# EAGLE board UFBmod_2V0 (EAGLE 7.7.0)
UFBmod - the best digital modulation ever created :-)
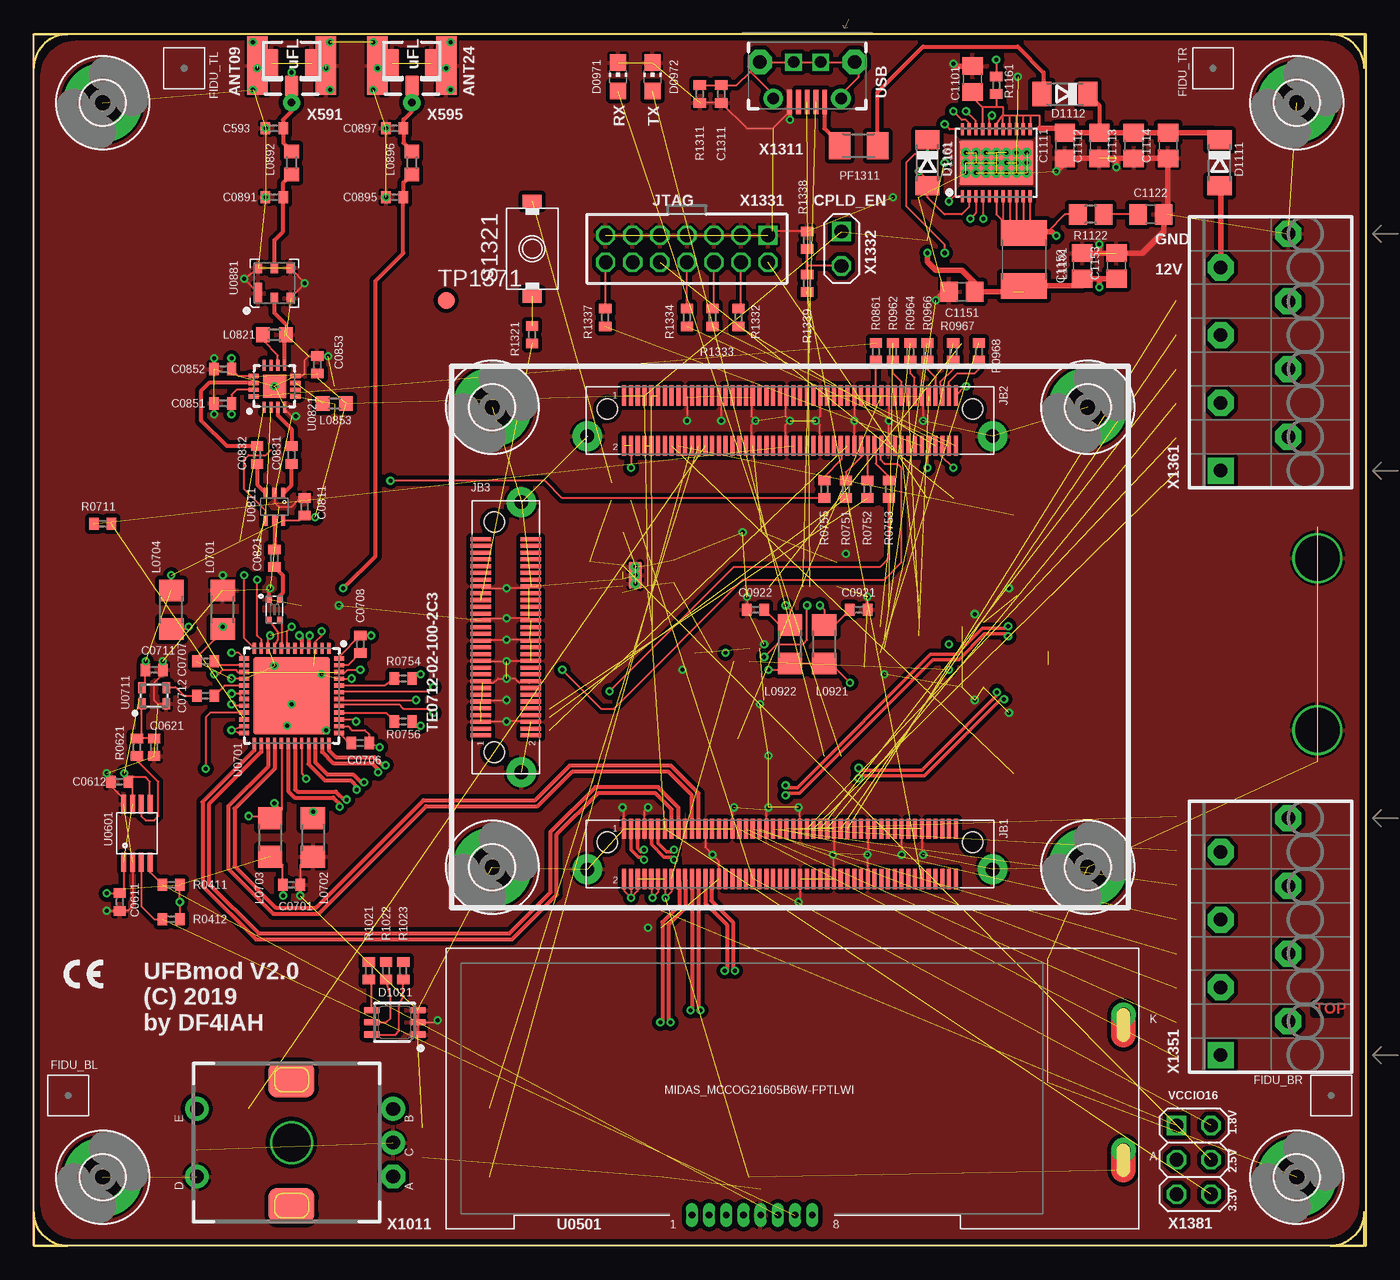
[diagram p15: board, top side]
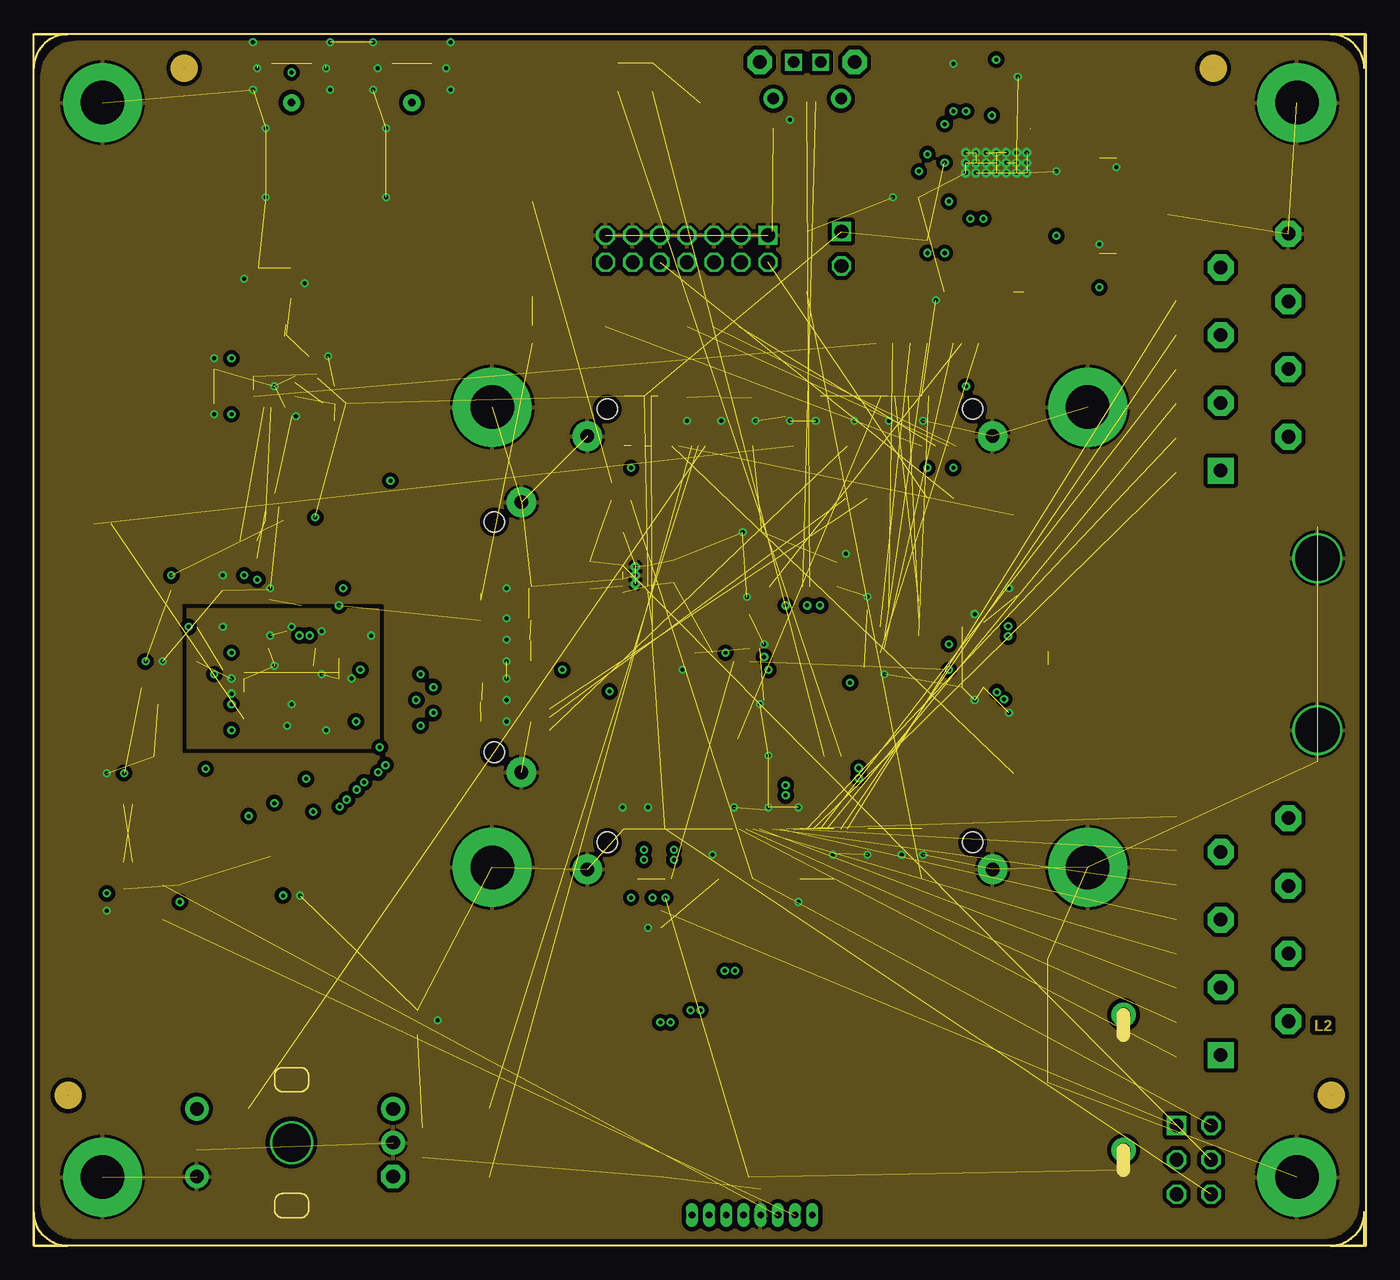
[diagram p16: board, inner layer Route2]
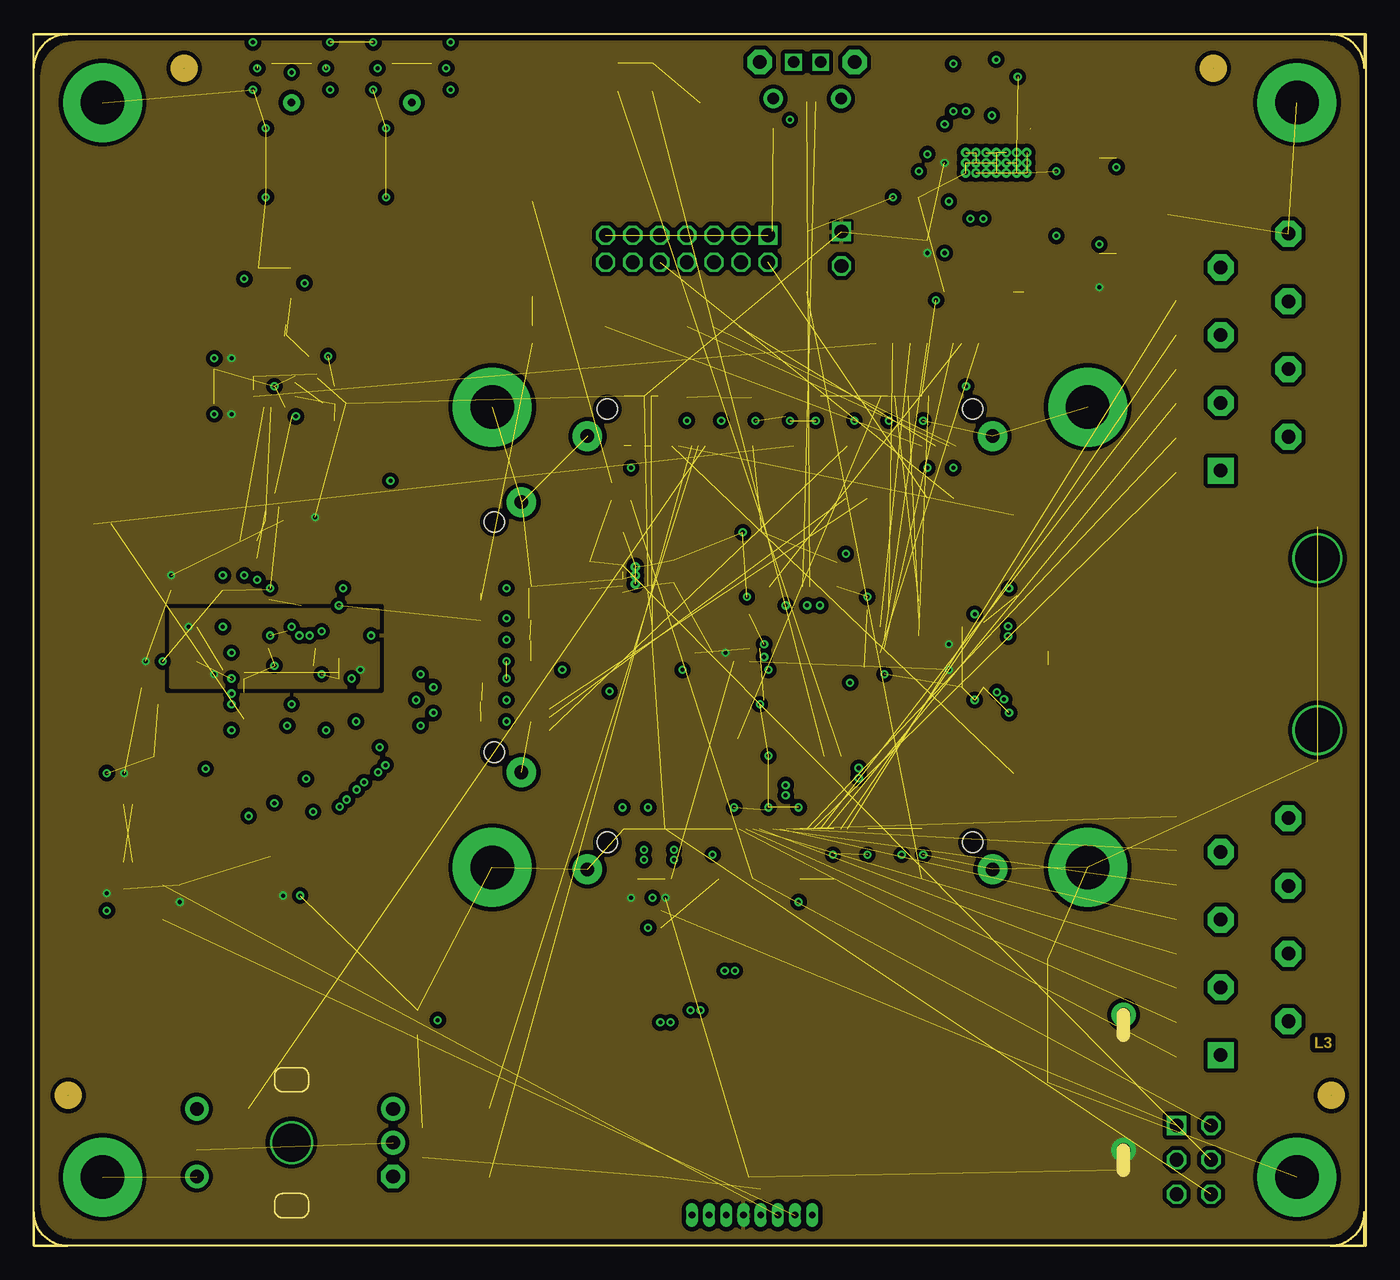
[diagram p17: board, inner layer Route15]
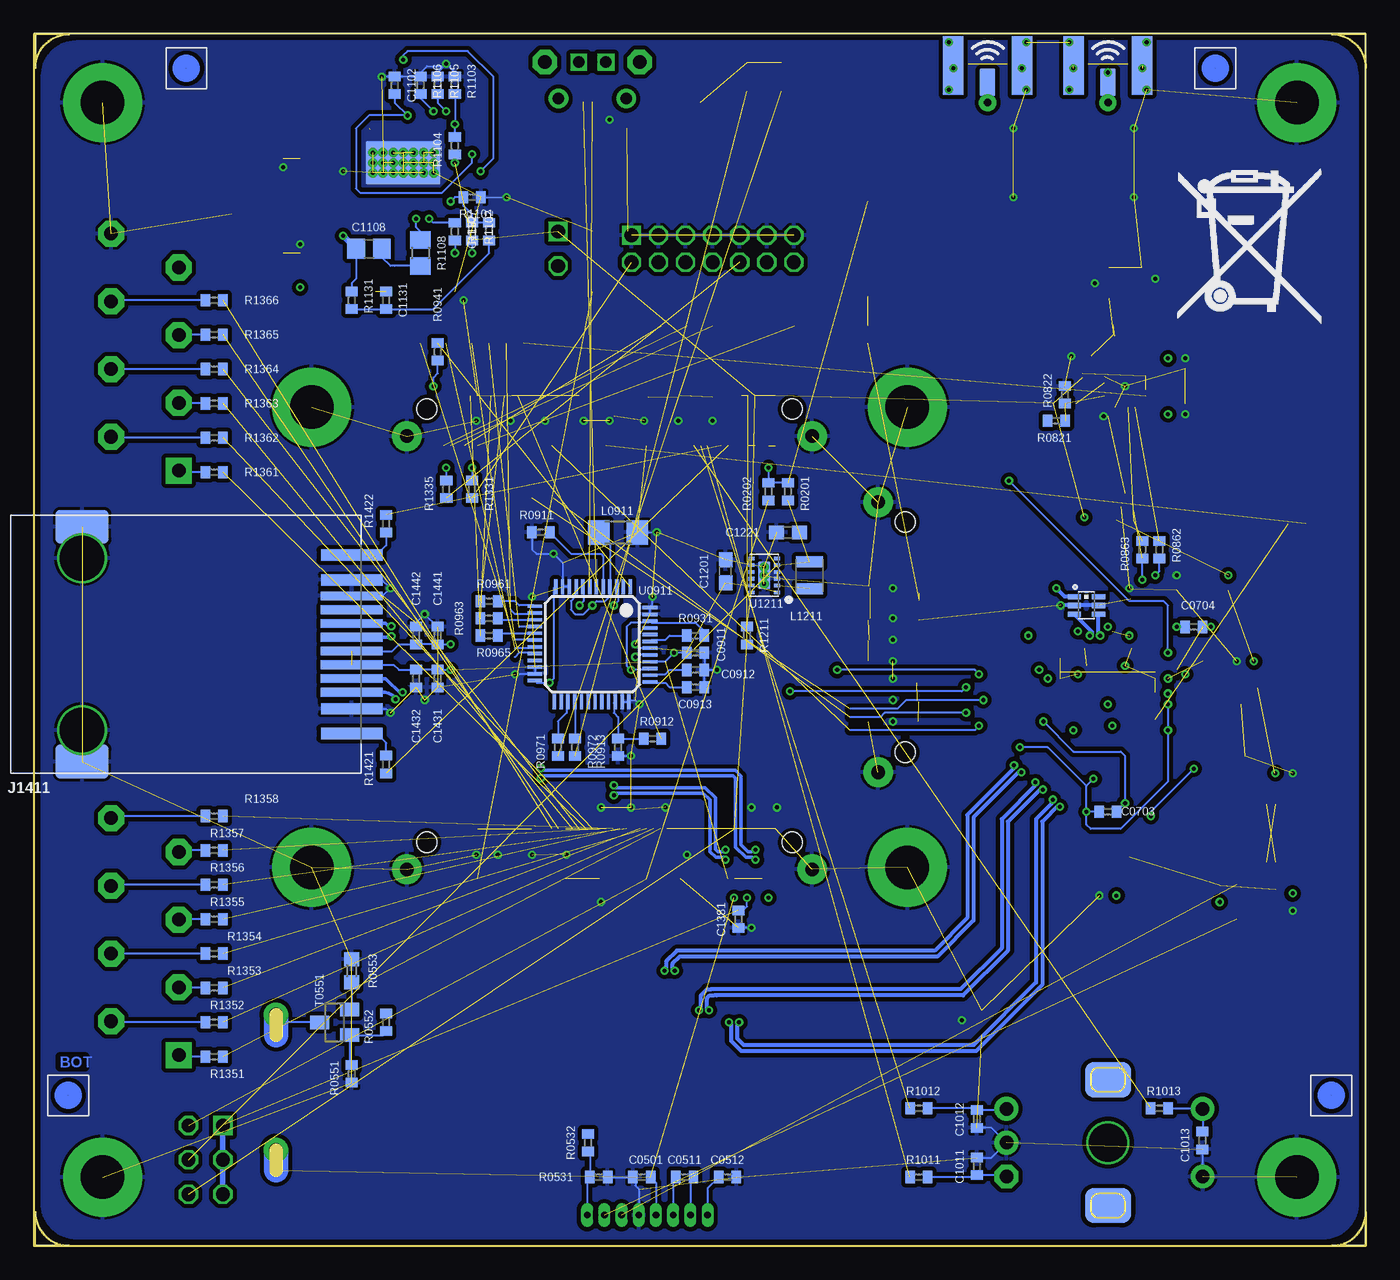
[diagram p18: board, bottom side, seen from below]

Size 98.42 x 89.53 mm. Coordinates in mm from the lower left corner, seen from the top.
Outline: 0,0 0,89.53 98.42,89.53 98.42,0 0,0
Copper layers (1+2*15+16): Top 0.035mm / dielectric 0.38mm / Route2 0.035mm / dielectric 0.71mm / Route15 0.035mm / dielectric 0.38mm / Bottom 0.035mm
Design rules "PCB-POOL Standard_ML4": minimum track width 0.15mm, minimum drill 0.3mm, track to track 0.15mm, track to pad 0.15mm, pad to pad 0.15mm, via to via 0.15mm, smd to smd 0.15mm, copper to edge 0.3mm, drill to drill 0.2mm, minimum pad ring 0.2mm, minimum via ring 0.15mm, stop-mask expansion 0.075mm, vias tented up to drill 0mil, thermal gap 0.2mm
Net classes: 0 default: drill 0.3 mm; 1 diff_100R: width 0.3 mm, clearance 0.15 mm; 2 pwr_ttl: width 0.75 mm, clearance 0.5 mm; 3 usb_pair: width 0.254 mm, clearance 0.152 mm; 4 pwrA5: width 0.4 mm; 5 single50R: width 0.838 mm, clearance 0.152 mm; 6 mil6_nofill: width 0.152 mm, clearance 0.254 mm
Milling: area 0,87 to 2.5,89.5; area 0,0 to 2.5,2.5; area 95.8,0 to 98.3,2.5; area 95.8,87 to 98.3,89.5

## Footprints (pad centres in the part's own frame; a part is rotated, then mirrored left to right if it is on the bottom)
C0402 = smd 0.7 x 0.9: 1 -0.65,0; 2 0.65,0
C0805 = smd 1.3 x 1.5: 1 -0.95,0; 2 0.95,0
C0603 = smd 1.1 x 1: 1 -0.85,0; 2 0.85,0
CHIP-LED0805 = smd 1.2 x 1.2: A 0,-1.05; C 0,1.05
ASMT-YTB7_0AA02_RGB = smd 1.2 x 0.5: 1 -1.7,0.9; 2 -1.7,0; 3 -1.7,-0.9; 4 1.7,-0.9; 5 1.7,0; 6 1.7,0.9
SOD80C = smd 1.4 x 1.8: A 1.7,0; C -1.7,0
3,2-PAD = drill 3.2 pad 5.842: B3,2 0,0
ARJE-0034_RJ45_WITH_MAGNETICS = smd 0.813 x 4.597: 1 6.604,11.43; 2 4.775,11.43; 11 -4.75,11.43; 12 -6.579,11.43 | smd 0.61 x 4.597: 3 3.556,11.43; 4 2.54,11.43; 5 1.524,11.43; 6 0.508,11.43; 7 -0.508,11.43; 8 -1.524,11.43; 9 -2.54,11.43; 10 -3.556,11.43 | smd 2.489 x 3.912: GND@11 -8.674,-8.496; GND@21 8.674,-8.496 | drill 3.3 pad 3.7: GND@12 -6.35,-8.496; GND@22 6.35,-8.496
SAMTEC_LSHM-150-DV = smd 0.3 x 1.5: 1 12.25,-1.85; 2 12.25,1.85; 3 11.75,-1.85; 4 11.75,1.85; 5 11.25,-1.85; 6 11.25,1.85; 7 10.75,-1.85; 8 10.75,1.85; 9 10.25,-1.85; 10 10.25,1.85; 11 9.75,-1.85; 12 9.75,1.85; 13 9.25,-1.85; 14 9.25,1.85; 15 8.75,-1.85; 16 8.75,1.85; 17 8.25,-1.85; 18 8.25,1.85; 19 7.75,-1.85; 20 7.75,1.85; 21 7.25,-1.85; 22 7.25,1.85; 23 6.75,-1.85; 24 6.75,1.85; 25 6.25,-1.85; 26 6.25,1.85; 27 5.75,-1.85; 28 5.75,1.85; 29 5.25,-1.85; 30 5.25,1.85; 31 4.75,-1.85; 32 4.75,1.85; 33 4.25,-1.85; 34 4.25,1.85; 35 3.75,-1.85; 36 3.75,1.85; 37 3.25,-1.85; 38 3.25,1.85; 39 2.75,-1.85; 40 2.75,1.85; 41 2.25,-1.85; 42 2.25,1.85; 43 1.75,-1.85; 44 1.75,1.85; 45 1.25,-1.85; 46 1.25,1.85; 47 0.75,-1.85; 48 0.75,1.85; 49 0.25,-1.85; 50 0.25,1.85; 51 -0.25,-1.85; 52 -0.25,1.85; 53 -0.75,-1.85; 54 -0.75,1.85; 55 -1.25,-1.85; 56 -1.25,1.85; 57 -1.75,-1.85; 58 -1.75,1.85; 59 -2.25,-1.85; 60 -2.25,1.85; 61 -2.75,-1.85; 62 -2.75,1.85; 63 -3.25,-1.85; 64 -3.25,1.85; 65 -3.75,-1.85; 66 -3.75,1.85; 67 -4.25,-1.85; 68 -4.25,1.85; 69 -4.75,-1.85; 70 -4.75,1.85; 71 -5.25,-1.85; 72 -5.25,1.85; 73 -5.75,-1.85; 74 -5.75,1.85; 75 -6.25,-1.85; 76 -6.25,1.85; 77 -6.75,-1.85; 78 -6.75,1.85; 79 -7.25,-1.85; 80 -7.25,1.85; 81 -7.75,-1.85; 82 -7.75,1.85; 83 -8.25,-1.85; 84 -8.25,1.85; 85 -8.75,-1.85; 86 -8.75,1.85; 87 -9.25,-1.85; 88 -9.25,1.85; 89 -9.75,-1.85; 90 -9.75,1.85; 91 -10.25,-1.85; 92 -10.25,1.85; 93 -10.75,-1.85; 94 -10.75,1.85; 95 -11.25,-1.85; 96 -11.25,1.85; 97 -11.75,-1.85; 98 -11.75,1.85; 99 -12.25,-1.85; 100 -12.25,1.85 | drill 1 pad 2.2: F1 14.975,1.15; F2 -14.975,1.15 | hole 1.5: 13.5,-0.85; -13.5,-0.85
SAMTEC_LSHM-130-DV = smd 0.3 x 1.5: 1 7.25,-1.85; 2 7.25,1.85; 3 6.75,-1.85; 4 6.75,1.85; 5 6.25,-1.85; 6 6.25,1.85; 7 5.75,-1.85; 8 5.75,1.85; 9 5.25,-1.85; 10 5.25,1.85; 11 4.75,-1.85; 12 4.75,1.85; 13 4.25,-1.85; 14 4.25,1.85; 15 3.75,-1.85; 16 3.75,1.85; 17 3.25,-1.85; 18 3.25,1.85; 19 2.75,-1.85; 20 2.75,1.85; 21 2.25,-1.85; 22 2.25,1.85; 23 1.75,-1.85; 24 1.75,1.85; 25 1.25,-1.85; 26 1.25,1.85; 27 0.75,-1.85; 28 0.75,1.85; 29 0.25,-1.85; 30 0.25,1.85; 31 -0.25,-1.85; 32 -0.25,1.85; 33 -0.75,-1.85; 34 -0.75,1.85; 35 -1.25,-1.85; 36 -1.25,1.85; 37 -1.75,-1.85; 38 -1.75,1.85; 39 -2.25,-1.85; 40 -2.25,1.85; 41 -2.75,-1.85; 42 -2.75,1.85; 43 -3.25,-1.85; 44 -3.25,1.85; 45 -3.75,-1.85; 46 -3.75,1.85; 47 -4.25,-1.85; 48 -4.25,1.85; 49 -4.75,-1.85; 50 -4.75,1.85; 51 -5.25,-1.85; 52 -5.25,1.85; 53 -5.75,-1.85; 54 -5.75,1.85; 55 -6.25,-1.85; 56 -6.25,1.85; 57 -6.75,-1.85; 58 -6.75,1.85; 59 -7.25,-1.85; 60 -7.25,1.85 | drill 1 pad 2.2: F1 9.975,1.15; F2 -9.975,1.15 | hole 1.5: 8.5,-0.85; -8.5,-0.85
R1206 = smd 1.6 x 1.803: 1 -1.422,0; 2 1.422,0
DXW21HN5011BL = smd 0.5 x 0.45: 1 -0.775,-0.4; 2 0.775,-0.4; 3 0.775,0.4; 4 -0.775,0.4
2450BL15B050 = smd 0.35 x 1: 1 -0.65,-0.9; 2 0,-0.9; 3 0.65,-0.9; 4 0.65,0.9; 5 0,0.9; 6 -0.65,0.9
L0603 = smd 1 x 1.1: 1 -0.85,0; 2 0.85,0
L1812 = smd 1.9 x 3.4: 1 -1.95,0; 2 1.95,0
L2520 = smd 0.8 x 2: 1 -1,0; 2 1,0
M1206 = smd 1.6 x 2: 1 -1.4,0; 2 1.4,0
R0402 = smd 0.7 x 0.9: 1 -0.65,0; 2 0.65,0
R0603 = smd 1 x 1.1: 1 -0.85,0; 2 0.85,0
R0805 = smd 1.3 x 1.5: 1 -0.95,0; 2 0.95,0
KSR223G_SMD_1POL = smd 1 x 1.4: 1 -3.5,0; 2 3.5,0
SOT23 = smd 1 x 1.4: 1 -0.95,-1.1; 2 0.95,-1.1; 3 0,1.1
B1,27 = smd 1.27 x 1.27: TP 0,0
MIDAS_MCCOG21605B6W-FPTLWI = drill 0.5 pad 0.7 long: 1 18.155,1; 2 19.425,1; 3 20.695,1; 4 21.965,1; 5 23.235,1; 6 24.505,1; 7 25.775,1; 8 27.045,1 | drill 1 pad 1.8: 11 50.05,15.8; 12 50.05,5.8
µMAX8 = smd 1.35 x 0.4: 1 -2.15,0.975; 2 -2.15,0.325; 3 -2.15,-0.325; 4 -2.15,-0.975; 5 2.15,-0.975; 6 2.15,-0.325; 7 2.15,0.325; 8 2.15,0.975
QFN48_7X7-0P5-PAD = smd 0.8 x 0.3: 1 -3.5,2.75; 2 -3.5,2.25; 3 -3.5,1.75; 4 -3.5,1.25; 5 -3.5,0.75; 6 -3.5,0.25; 7 -3.5,-0.25; 8 -3.5,-0.75; 9 -3.5,-1.25; 10 -3.5,-1.75; 11 -3.5,-2.25; 12 -3.5,-2.75; 25 3.5,-2.75; 26 3.5,-2.25; 27 3.5,-1.75; 28 3.5,-1.25; 29 3.5,-0.75; 30 3.5,-0.25; 31 3.5,0.25; 32 3.5,0.75; 33 3.5,1.25; 34 3.5,1.75; 35 3.5,2.25; 36 3.5,2.75 | smd 0.3 x 0.8: 13 -2.75,-3.5; 14 -2.25,-3.5; 15 -1.75,-3.5; 16 -1.25,-3.5; 17 -0.75,-3.5; 18 -0.25,-3.5; 19 0.25,-3.5; 20 0.75,-3.5; 21 1.25,-3.5; 22 1.75,-3.5; 23 2.25,-3.5; 24 2.75,-3.5; 37 2.75,3.5; 38 2.25,3.5; 39 1.75,3.5; 40 1.25,3.5; 41 0.75,3.5; 42 0.25,3.5; 43 -0.25,3.5; 44 -0.75,3.5; 45 -1.25,3.5; 46 -1.75,3.5; 47 -2.25,3.5; 48 -2.75,3.5 | smd 5.65 x 5.65: 49 0,0
ASVTX-13 = smd 0.6 x 0.8: 1 -0.9,-0.6; 2 0.9,-0.6; 3 0.9,0.6; 4 -0.9,0.6
SC-70_6-LEAD_2X1MM25_0P65 = smd 0.4 x 0.8: 1 -0.65,-1; 2 0,-1; 3 0.65,-1; 4 0.65,1; 5 0,1; 6 -0.65,1
QFN16-3X3-0P5-PAD = smd 0.8 x 0.3: 1 -1.55,0.75; 2 -1.55,0.25; 3 -1.55,-0.25; 4 -1.55,-0.75; 9 1.55,-0.75; 10 1.55,-0.25; 11 1.55,0.25; 12 1.55,0.75 | smd 0.3 x 0.8: 5 -0.75,-1.55; 6 -0.25,-1.55; 7 0.25,-1.55; 8 0.75,-1.55; 13 0.75,1.55; 14 0.25,1.55; 15 -0.25,1.55; 16 -0.75,1.55 | smd 1.7 x 1.7: 17 0,0
B3440_3MM-X-3MM = smd 0.65 x 1.55: 1 -1.2,-0.75 | smd 0.65 x 0.8: 2 0,-1.125; 3 1.2,-1.125; 4 1.2,1.125; 5 0,1.125; 6 -1.2,1.125
LQFP48 = smd 1.1 x 0.25: 1 -4.25,2.8; 2 -4.25,2.3; 3 -4.25,1.8; 4 -4.25,1.3; 5 -4.25,0.8; 6 -4.25,0.3; 7 -4.25,-0.2; 8 -4.25,-0.7; 9 -4.25,-1.2; 10 -4.25,-1.7; 11 -4.25,-2.2; 12 -4.25,-2.7; 25 4.25,-2.8; 26 4.25,-2.3; 27 4.25,-1.8; 28 4.25,-1.3; 29 4.25,-0.8; 30 4.25,-0.3; 31 4.25,0.2; 32 4.25,0.7; 33 4.25,1.2; 34 4.25,1.7; 35 4.25,2.2; 36 4.25,2.7 | smd 0.25 x 1.1: 13 -2.8,-4.25; 14 -2.3,-4.25; 15 -1.8,-4.25; 16 -1.3,-4.25; 17 -0.8,-4.25; 18 -0.3,-4.25; 19 0.2,-4.25; 20 0.7,-4.25; 21 1.2,-4.25; 22 1.7,-4.25; 23 2.2,-4.25; 24 2.7,-4.25; 37 2.8,4.25; 38 2.3,4.25; 39 1.8,4.25; 40 1.3,4.25; 41 0.8,4.25; 42 0.3,4.25; 43 -0.2,4.25; 44 -0.7,4.25; 45 -1.2,4.25; 46 -1.7,4.25; 47 -2.2,4.25; 48 -2.7,4.25
DQP-22 = smd 0.28 x 0.85: 1 -2.5,-2.475; 2 -2,-2.475; 3 -1.5,-2.475; 4 -1,-2.475; 5 -0.5,-2.475; 6 0,-2.475; 7 0.5,-2.475; 8 1,-2.475; 9 1.5,-2.475; 10 2,-2.475; 11 2.5,-2.475; 12 2.5,2.475; 13 2,2.475; 14 1.5,2.475; 15 1,2.475; 16 0.5,2.475; 17 0,2.475; 18 -0.5,2.475; 19 -1,2.475; 20 -1.5,2.475; 21 -2,2.475; 22 -2.5,2.475 | smd 5.48 x 3.24: 23 0,0 | smd 5.48 x 3.24 bottom: 24 0,0 | drill 0.3 pad 0.61: P$1 -2.25,-0.75; P$2 -1.5,-0.75; P$3 -0.75,-0.75; P$4 0,-0.75; P$5 0.75,-0.75; P$6 1.5,-0.75; P$7 2.25,-0.75; P$8 -2.25,0; P$9 -1.5,0; P$10 -0.75,0; P$11 0,0; P$12 0.75,0; P$13 1.5,0; P$14 2.25,0; P$15 -2.25,0.75; P$16 -1.5,0.75; P$17 -0.75,0.75; P$18 0,0.75; P$19 0.75,0.75; P$20 1.5,0.75; P$21 2.25,0.75
WSON-12 = smd 0.5 x 0.25: 1 -0.95,1.25; 2 -0.95,0.75; 3 -0.95,0.25; 4 -0.95,-0.25; 5 -0.95,-0.75; 6 -0.95,-1.25; 7 0.95,-1.25; 8 0.95,-0.75; 9 0.95,-0.25; 10 0.95,0.25; 11 0.95,0.75; 12 0.95,1.25 | smd 0.9 x 2: 13 0,0 | smd 0.9 x 2 bottom: 14 0,0 | drill 0.3 pad 0.6: G1 0,0; G2 0,0.635; G3 0,-0.635
SMA_UFL_PAD_TINY = smd 1.524 x 1.016: ANT1 -3.843,0 | drill 0.559 pad 1.27: ANT2 -5.08,0 | smd 2.032 x 1.143 bottom: ANT3 -3.589,0 | smd 2.2 x 1.016: GND1 -2.223,1.47; GND2 -2.223,-1.47 | smd 4.318 x 1.524: GND3 -2.349,-2.54; GND4 -2.349,2.54 | smd 4.318 x 1.524 bottom: GND5 -2.349,2.54; GND6 -2.349,-2.54
TTE_EN11-HSM = drill 1 pad 1.75 octagon: A -2.5,-7.5 | drill 1 pad 1.75: B 2.5,-7.5; C 0,-7.5; D -2.5,7; E 2.5,7 | smd 2.6 x 3.4: GND11 -4.65,0; GND12 4.65,0 | smd 2.6 x 3.4 bottom: GND21 -4.65,0; GND22 4.65,0 | drill 2.8 pad 2.8: P$1 0,0
USB-B-MICRO-SMD_MOLEX-105017-0001 = smd 0.35 x 1.8: D+ 0,4.4; D- -0.65,4.4; GND 1.3,4.4; ID 0.65,4.4; VBUS -1.3,4.4 | drill 0.85 pad 1.45: JSHIELD -2.5,4.15; JSHIELD@2 2.5,4.15 | drill 1 pad 1.8 octagon: JSHIELD@3 -3.5,1.45; JSHIELD@6 3.5,1.45 | drill 0.85 square: JSHIELD@4 -1,1.45; JSHIELD@5 1,1.45
2X07_2MM00_SHROUDED_XILINX_JTAG = drill 1.016 square: 1 -6,-1 | drill 1.016 octagon: 2 -6,1; 3 -4,-1; 4 -4,1; 5 -2,-1; 6 -2,1; 7 0,-1; 8 0,1; 9 2,-1; 10 2,1; 11 4,-1; 12 4,1; 13 6,-1; 14 6,1
1X02 = drill 1.016 square: 1 0,0 | drill 1.016 octagon: 2 0,2.54
PHOENIX_1990067_1X8X2MM50_PTSA-0-5 = drill 1 pad 1.93 square: 1 -7.5,5 | drill 1 pad 1.93 octagon: 2 -5,0; 3 -2.5,5; 4 0,0; 5 2.5,5; 6 5,0; 7 7.5,5; 8 10,0
2X03 = drill 1.016 square: 1 -2.54,-1.27 | drill 1.016 octagon: 2 -2.54,1.27; 3 0,-1.27; 4 0,1.27; 5 2.54,-1.27; 6 2.54,1.27

## Placement (x,y rotation side)
C0501  100nF  [C0402]  53.5,5.08 180 bottom
C0511  1uF  [C0402]  50.32,5.08 0 bottom
C0512  1uF  [C0402]  47.15,5.08 0 bottom
C593  0pF  [C0402]  17.78,82.55 180 top
C0611  100nF  [C0402]  6.35,25.4 270 top
C0612  100nF  [C0402]  6.35,34.29 180 top
C0621  1uF  [C0402]  8.89,36.83 270 top
C0701  1uF  [C0402]  19.05,26.67 0 top
C0703  1nF  [C0402]  19.05,32.07 180 bottom
C0704  1nF  [C0402]  12.7,45.72 180 bottom
C0706  100nF  [C0402]  24.13,37.15 180 top
C0707  100nF  [C0402]  12.7,43.18 0 top
C0708  100nF  [C0402]  24.13,44.45 270 top
C0711  10nF  [C0402]  8.89,42.55 0 top
C0712  10nF  [C0402]  12.7,40.64 0 top
C0811  100nF  [C0402]  20,54.61 90 top
C0821  1nF  [C0402]  17.78,50.8 270 top
C0831  1nF  [C0402]  19.05,58.42 270 top
C0832  1nF  [C0402]  16.51,58.42 270 top
C0851  10nF  [C0402]  13.97,62.23 180 top
C0852  10nF  [C0402]  13.97,64.77 180 top
C0853  10nF  [C0402]  20.95,65.09 90 top
C0891  0pF  [C0402]  17.78,77.47 180 top
C0895  0pF  [C0402]  26.67,77.47 180 top
C0897  0pF  [C0402]  26.67,82.55 180 top
C0911  100nF  [C0402]  49.53,43.81 0 bottom
C0912  100nF  [C0402]  49.53,42.55 180 bottom
C0913  100nF  [C0402]  49.53,41.27 180 bottom
C0921  100nF  [C0402]  60.96,46.99 180 top
C0922  100nF  [C0402]  53.34,46.99 0 top
C1011  100nF  [C0402]  28.73,5.87 90 bottom
C1012  100nF  [C0402]  28.73,9.37 270 bottom
C1013  100nF  [C0402]  12.06,7.78 270 bottom
C1101  4.7uF  [C0805]  69.37,86.2 270 top
C1102  1uF  [C0402]  71.75,85.72 270 bottom
C1108  100nF  [C0805]  73.66,73.66 0 bottom
C1111  22uF  [C0805]  76.2,81.28 90 top
C1112  22uF  [C0805]  78.74,81.28 90 top
C1113  22uF  [C0805]  81.28,81.28 90 top
C1114  22uF  [C0805]  83.82,81.28 90 top
C1122  N/A  [C0805]  82.55,76.2 0 top
C1131  100nF  [C0402]  72.39,69.85 270 bottom
C1132  1nF  [C0402]  64.77,74.93 90 bottom
C1151  100uF  [C0805]  68.58,70.48 180 top
C1152  100uF  [C0805]  77.47,72.39 90 top
C1153  100uF  [C0805]  80.01,72.39 90 top
C1201  10uF  [C0603]  47.31,49.85 90 bottom
C1221  10uF  [C0603]  42.7,52.7 180 bottom
C1311  1nF  [C0402]  50.8,85.09 90 top
C1381  100nF  [C0402]  46.35,24.13 90 bottom
C1431  1uF  [C0402]  68.58,41.91 270 bottom
C1432  100nF  [C0402]  70.17,41.91 270 bottom
C1441  1uF  [C0402]  68.58,45.09 90 bottom
C1442  100nF  [C0402]  70.17,45.09 90 bottom
D0971  CMD17-21VGD/TR8 GREEN  [CHIP-LED0805]  43.18,86.36 0 top
D0972  CMD17-21VRD/TR8 RED  [CHIP-LED0805]  45.72,86.36 0 top
D1021  ASMT-YTB7-0AA02_RGB  [ASMT-YTB7_0AA02_RGB]  26.67,16.51 180 top
D1111  CRS08  [SOD80C]  87.63,80.01 270 top
D1112  CRS08  [SOD80C]  76.2,85.09 180 top
D1161  CRS08  [SOD80C]  66.04,80.01 270 top
FIDU_BL  [FIDUCIAL_MARK_1MM]  2.54,11.11 0 top
FIDU_BR  [FIDUCIAL_MARK_1MM]  95.89,11.11 0 top
FIDU_TL  [FIDUCIAL_MARK_1MM]  11.11,87 0 top
FIDU_TR  [FIDUCIAL_MARK_1MM]  87.15,87 0 top
H1511  MOUNT-PAD-ROUND3.2  [3,2-PAD]  5.08,84.45 0 top
H1512  MOUNT-PAD-ROUND3.2  [3,2-PAD]  5.08,5.08 0 top
H1513  MOUNT-PAD-ROUND3.2  [3,2-PAD]  93.34,84.45 0 top
H1514  MOUNT-PAD-ROUND3.2  [3,2-PAD]  93.34,5.08 0 top
HB_351  MOUNT-PAD-ROUND3.2  [3,2-PAD]  77.88,27.96 180 top
HB_352  MOUNT-PAD-ROUND3.2  [3,2-PAD]  77.88,61.96 180 top
HB_353  MOUNT-PAD-ROUND3.2  [3,2-PAD]  33.88,27.96 180 top
HB_354  MOUNT-PAD-ROUND3.2  [3,2-PAD]  33.88,61.96 180 top
J1411  [ARJE-0034_RJ45_WITH_MAGNETICS]  86.36,44.45 270 bottom
JB1  LSHM-150-04.0-L-DV-A-S-K-TR  [SAMTEC_LSHM-150-DV]  55.88,28.96 180 top
JB2  LSHM-150-04.0-L-DV-A-S-K-TR  [SAMTEC_LSHM-150-DV]  55.88,60.96 180 top
JB3  LSHM-130-04.0-L-DV-A-S-K-TR  [SAMTEC_LSHM-130-DV]  34.88,44.96 270 top
L0701  300R  [R1206]  13.97,46.99 270 top
L0702  300R  [R1206]  20.64,30.16 90 top
L0703  300R  [R1206]  17.46,30.16 90 top
L0704  300R  [R1206]  10.16,46.99 270 top
L0721  MURATA DXW21HN5011BL  [DXW21HN5011BL]  17.78,46.99 270 top
L0722  Johanson 2450BL15B050E  [2450BL15B050]  20.64,47.31 270 bottom
L0821  2.7nH  [L0603]  17.78,67.31 0 top
L0853  6.8nH  [L0603]  22.23,62.23 180 top
L0892  0nH  [L0603]  19.05,80.01 90 top
L0896  0nH  [L0603]  27.94,80.01 90 top
L0911  300R  [R1206]  55.24,52.7 180 bottom
L0921  300R  [R1206]  58.42,44.45 270 top
L0922  300R  [R1206]  55.88,44.45 270 top
L1101  440nH  [L1812]  73.18,72.87 90 top
L1211  4.7uH  [L2520]  41.12,49.53 270 bottom
PF1311  1.1A/2.2A  [M1206]  60.96,81.28 180 top
R0201  0R  [R0402]  42.7,55.72 90 bottom
R0202  N/A  [R0402]  44.13,55.72 90 bottom
R0411  3.9kR  [R0402]  10.16,26.67 0 top
R0412  3.9kR  [R0402]  10.16,24.13 0 top
R0531  220kR  [R0402]  56.67,5.08 180 bottom
R0532  1kR  [R0402]  57.47,7.62 270 bottom
R0551  1.5kR  [R0402]  74.93,12.7 90 bottom
R0552  2.0kR  [R0402]  72.39,16.51 90 bottom
R0553  27R  [R0603]  74.93,20.32 270 bottom
R0621  100kR  [R0402]  7.62,36.83 90 top
R0711  100R  [R0402]  5.08,53.34 0 top
R0751  100R  [R0402]  60.01,55.88 90 top
R0752  100R  [R0402]  61.59,55.88 90 top
R0753  100R  [R0402]  63.18,55.88 90 top
R0754  100R  [R0402]  27.3,41.91 0 top
R0755  100R  [R0402]  58.42,55.88 90 top
R0756  100R  [R0402]  27.3,38.73 0 top
R0821  100R  [R0402]  22.86,60.96 180 bottom
R0822  10kR  [R0402]  22.23,62.87 270 bottom
R0861  10kR  [R0402]  62.23,66.04 90 top
R0862  10kR  [R0402]  15.24,51.44 90 bottom
R0863  10kR  [R0402]  16.51,51.44 90 bottom
R0911  12kR 1%0  [R0402]  60.96,52.7 0 bottom
R0912  100R  [R0402]  52.7,37.47 180 bottom
R0913  100kR  [R0402]  55.24,36.83 90 bottom
R0931  10kR  [R0402]  49.53,45.09 0 bottom
R0941  100R  [R0402]  68.58,66.04 90 bottom
R0961  100R  [R0402]  64.77,47.62 180 bottom
R0962  100R  [R0402]  63.5,66.04 270 top
R0963  100R  [R0402]  64.77,46.35 180 bottom
R0964  100R  [R0402]  64.77,66.04 270 top
R0965  100R  [R0402]  64.77,45.09 180 bottom
R0966  100R  [R0402]  66.04,66.04 270 top
R0967  100R  [R0402]  67.94,66.04 270 top
R0968  100R  [R0402]  69.85,66.04 270 top
R0971  1kR  [R0402]  59.69,36.83 270 bottom
R0972  1kR  [R0402]  58.42,36.83 270 bottom
R1011  1kR  [R0402]  33.02,5.08 180 bottom
R1012  1kR  [R0402]  33.02,10.16 180 bottom
R1013  1kR  [R0402]  15.24,10.16 180 bottom
R1021  820R  [R0402]  24.77,20.32 90 top
R1022  1kR  [R0402]  26.04,20.32 90 top
R1023  820R  [R0402]  27.3,20.32 90 top
R1101  10kR 0%5  [R0402]  66.04,77.47 180 bottom
R1102  45.3kR 0%5  [R0402]  66.04,74.93 270 bottom
R1103  187kR  [R0402]  67.31,85.72 270 bottom
R1104  N/A  [R0402]  67.31,81.28 90 bottom
R1105  110kR  [R0402]  68.58,85.72 270 bottom
R1106  200kR  [R0402]  69.85,85.72 270 bottom
R1107  100kR  [R0402]  67.31,74.93 270 bottom
R1108  2R  [R0805]  69.85,73.34 270 bottom
R1122  N/A  [R0805]  78.11,76.2 180 top
R1131  3.01kR  [R0402]  74.93,69.85 270 bottom
R1161  220kR  [R0402]  71.12,85.72 270 top
R1211  10kR  [R0402]  45.72,45.09 90 bottom
R1311  330kR  [R0402]  49.21,85.09 90 top
R1321  100R  [R0402]  36.83,67.31 90 top
R1331  1kR  [R0402]  66.04,55.88 90 bottom
R1332  100R  [R0402]  52.07,68.58 270 top
R1333  100R  [R0402]  50.16,68.58 270 top
R1334  100R  [R0402]  48.26,68.58 270 top
R1335  100R  [R0402]  67.94,55.88 90 bottom
R1337  100R  [R0402]  42.23,68.58 270 top
R1338  10kR  [R0402]  57.15,74.3 90 top
R1339  100R  [R0402]  57.15,71.12 270 top
R1351  100R  [R0402]  85.09,13.97 180 bottom
R1352  100R  [R0402]  85.09,16.51 180 bottom
R1353  100R  [R0402]  85.09,19.05 180 bottom
R1354  100R  [R0402]  85.09,21.59 180 bottom
R1355  100R  [R0402]  85.09,24.13 180 bottom
R1356  100R  [R0402]  85.09,26.67 180 bottom
R1357  100R  [R0402]  85.09,29.21 180 bottom
R1358  100R  [R0402]  85.09,31.75 180 bottom
R1361  100R  [R0402]  85.09,57.15 180 bottom
R1362  100R  [R0402]  85.09,59.69 180 bottom
R1363  100R  [R0402]  85.09,62.23 180 bottom
R1364  100R  [R0402]  85.09,64.77 180 bottom
R1365  100R  [R0402]  85.09,67.31 180 bottom
R1366  100R  [R0402]  85.09,69.85 180 bottom
R1421  1kR  [R0402]  72.39,35.56 90 bottom
R1422  1kR  [R0402]  72.39,53.34 270 bottom
S1321  KSR223G_SMD_1POL  [KSR223G_SMD_1POL]  36.83,73.66 90 top
T0551  MMBT2222  [SOT23]  76.2,16.51 90 bottom
TP1371  TPB1,27  [B1,27]  30.48,69.85 0 top
U0501  MIDAS_MCCOG21605B6W-FPTLWI  [MIDAS_MCCOG21605B6W-FPTLWI]  30.48,1.27 0 top
U0601  MAX5217  [µMAX8]  7.62,30.48 90 top
U0701  AT86RF215-ZU  [QFN48_7X7-0P5-PAD]  19.05,40.64 270 top
U0711  ASVTX-13-D-26.000MHZ-I05-T  [ASVTX-13]  8.89,40.64 0 top
U0811  PE4259  [SC-70_6-LEAD_2X1MM25_0P65]  17.78,54.61 180 top
U0821  RFX1010  [QFN16-3X3-0P5-PAD]  17.78,63.5 90 top
U0881  B39871B3440U410  [B3440_3MM-X-3MM]  17.78,71.12 0 top
U0911  FT232HL  [LQFP48]  57.15,44.45 270 bottom
U1101  TPS53353  [DQP-22]  71.12,80.01 0 top
U1211  TPS62745DSSR  [WSON-12]  44.45,49.53 180 bottom
X0891  ANTENNATINY  [SMA_UFL_PAD_TINY]  19.05,89.53 90 top
X0895  ANTENNATINY  [SMA_UFL_PAD_TINY]  27.94,89.53 90 top
X1011  TTE_EN11-HSM  [TTE_EN11-HSM]  19.05,7.62 90 top
X1311  MOLEX 105017-0001  [USB-B-MICRO-SMD_MOLEX-105017-0001]  57.15,88.9 180 top
X1331  [2X07_2MM00_SHROUDED_XILINX_JTAG]  48.26,73.66 180 top
X1332  [1X02]  59.69,74.93 180 top
X1351  PHOENIX_1990067_1X8X2MM50_PTSA-0-5  [PHOENIX_1990067_1X8X2MM50_PTSA-0-5]  92.71,21.59 90 top
X1361  PHOENIX_1990067_1X8X2MM50_PTSA-0-5  [PHOENIX_1990067_1X8X2MM50_PTSA-0-5]  92.71,64.77 90 top
X1381  [2X03]  85.72,6.35 270 top

## Tracks (layer width: path | path; a pad name or v marks a point on that pad's centre or on a via)
26MHZ_DAC_OUT
  Top 0.152: U0601.6 7.94,32.64 7.94,31.75 8.26,31.43 8.89,31.43 9.21,31.75 9.21,34.29 7.62,35.88 R0621.1
+2V5  (4 unrouted)
+3V3  (via drill 0.3)  (30 unrouted)
  Top 0.15: C0811.1 20.15,53.82 v20.8,53.82
  Top 0.152: L0703.1 18.4,28.12 C0701.1 18.4,26.05 v18.41,25.88 | R0411.2 10.79,26.66 v10.79,25.4 10.79,24.14 R0412.2 | v5.4,26.04 6.33,26.04 C0611.1 6.64,26.34 U0601.1 | U0601.7 7.3,32.64 7.3,33.97 7,34.27 C0612.1 7,34.62 | U0601.5 8.57,32.65 8.57,34.29 8.26,34.61 7.3,34.61 7,34.62 | 7,34.62 6.7,34.92 v6.67,34.92 | v8.26,43.18 8.26,42.56 C0711.1 8.24,41.49 U0711.4 | L0704.1 v10.16,49.53 | U0811.6 19.65,53.61 C0811.1 | U0821.13 15.14,64.25 C0852.1 | U0821.15 14.99,63.25 14.61,62.87 14.61,62.24 C0851.1 | 20.95,64.14 C0853.1 | JB1.4 v44.13,25.72 | JB1.2 43.63,26.22 v44.13,25.72 | JB1.6 44.63,26.21 v44.13,25.72 | JB1.14 46.63,25.76 v46.67,25.72 47.13,26.18 JB1.16
  Top 0.3: v14.61,65.56 14.61,64.78 C0852.1 | v14.61,61.44 14.61,62.22 C0851.1
  Top 0.406: 78.74,71.44 C1152.1 77.47,70.92 L1101.1 73.18,70.48 C1151.1 69.53,71.12 68.58,72.07 66.67,72.07 66.04,72.71 v66.04,73.34 | 78.74,71.44 C1153.1 | v78.74,70.8 78.74,71.44
  Bottom 0.152: C0501.1 52.45,4.68 U0501.4 | J1411.5 71.82,42.93 71.44,42.55 70.18,42.55 C1432.1 C1431.1 67.64,42.56 v67.63,42.55 | J1411.6 71.94,43.94 71.44,44.45 70.18,44.45 C1442.1 C1441.1 67.64,44.44 v67.63,44.45 | R1104.1 v67.31,80.01 | R1102.2 v66.04,73.34 | C0911.1 v51.12,43.81 51.75,43.18 52.87,43.18 U0911.40
  pour Route15 (isolate 0.305, rank 2): 95.29,0.64 3.13,0.64 arc-90 0.64,3.13 0.64,86.4 arc-90 3.13,88.9 95.29,88.9 arc-90 97.79,86.4 97.79,3.13 arc-90
+5V_USB
  Top 0.305: PF1311.1 62.36,85.22 65.72,88.58 72.71,88.58 74.61,86.68 74.61,85.2 D1112.A
ANT09  (via drill 0.3)
  Top 0.3: C593.1 18.43,81.48 L0892.2 | 18.41,82.56 18.41,83.19 19.05,83.82 X0891.ANT2 X0891.ANT1 v19.05,86.68
  Top 0.406: 18.41,82.56 C593.1
  Bottom 0.3: X0891.ANT3 v19.05,86.68
ANT09_MATCH
  Top 0.3: C0891.1 18.43,78.54 L0892.1 | U0881.5 17.78,74.3 18.41,74.93 18.41,77.45
  Top 0.406: 18.41,77.45 C0891.1
ANT24
  Top 0.3: L0896.2 27.32,81.48 C0897.1 27.32,83.2 27.94,83.82 X0895.ANT2 X0895.ANT1
  Bottom 0.3: X0895.ANT3 X0895.ANT2
B2W_51
  Bottom 0.152: R1351.2 87.71,13.97
  Bottom 0.305: 87.71,13.97 X1351.1
B2W_52
  Bottom 0.152: R1352.2 92.71,16.51 X1351.2
B2W_53
  Bottom 0.152: R1353.2 87.71,19.05 X1351.3
B2W_54
  Bottom 0.152: R1354.2 X1351.4
B2W_55
  Bottom 0.152: R1355.2 87.71,24.13 X1351.5
B2W_56
  Bottom 0.152: R1356.2 92.71,26.67 X1351.6
B2W_57
  Bottom 0.152: R1357.2 87.71,29.21 X1351.7
B2W_58
  Bottom 0.152: R1358.2 92.71,31.75 X1351.8
B2W_61
  Bottom 0.152: R1361.2 87.71,57.15 X1361.1
B2W_62
  Bottom 0.152: R1362.2 92.71,59.69 X1361.2
B2W_63
  Bottom 0.152: R1363.2 87.71,62.23 X1361.3
B2W_64
  Bottom 0.152: R1364.2 X1361.4
B2W_65
  Bottom 0.152: R1365.2 87.71,67.31 X1361.5
B2W_66
  Bottom 0.152: R1366.2 92.71,69.85 X1361.6
BOARD_ROTENC_I  (1 unrouted)
BOARD_ROTENC_PUSH  (1 unrouted)
BOARD_ROTENC_Q  (1 unrouted)
BOARD_SCL  (1 unrouted)
  Top 0.152: U0601.3 7.95,25.07 8.89,24.13 R0412.1
BOARD_SDA  (1 unrouted)
  Top 0.152: U0601.4 8.6,27.59 R0411.1
ETH_DA_G
  Bottom 0.152: R1422.2 72.39,51.75 73.03,51.12 74.84,51.12 J1411.12
ETH_DA_Y
  Bottom 0.152: R1421.2 72.39,37.15 73.03,37.78 74.87,37.78 J1411.1
FE09_ANT  (1 unrouted)
  Top 0.3: U0821.9 18.53,67.21 | 18.63,68.05 17.78,68.9 U0881.2
FE09_RX
  Top 0.3: C0832.1 14.27,59.07 12.38,60.96 12.38,63.18 12.95,63.75 U0821.14
FE09_TX
  Top 0.3: U0821.3 18.03,61.34 19.05,60.33 C0831.1
FPGA_B16_L7_N  (1 unrouted)
FPGA_B16_L7_P  (1 unrouted)
FPGA_B16_L9_N  (1 unrouted)
FPGA_B16_L9_P  (1 unrouted)
FPGA_B16_L11_N  (1 unrouted)
FPGA_B16_L11_P  (1 unrouted)
FPGA_B16_L16_N  (1 unrouted)
FPGA_B16_L16_P  (1 unrouted)
FPGA_B16_L17_N  (1 unrouted)
FPGA_B16_L17_P  (1 unrouted)
FPGA_B16_L18_N  (1 unrouted)
FPGA_B16_L18_P  (1 unrouted)
FPGA_B16_L19_N  (1 unrouted)
FPGA_B16_L19_P  (1 unrouted)
FPGA_ETH_DA_G  (1 unrouted)
FPGA_ETH_DA_Y  (1 unrouted)
FPGA_ETH_RD_N  (via drill 0.3)
  Top 0.254: v72,45.78 72.07,45.61 70.08,45.61 68.18,43.7 66.27,43.7 56.43,33.86 55.56,33.86 v55.56,34.03 | JB1.11 46.13,29.72 46.76,29.1 47.31,29.1 v47.31,29.27
  Bottom 0.254: J1411.8 72.44,45.97 72.07,45.61 v72,45.78 | v47.31,29.27 47.31,29.1 47.86,29.1 48.06,29.29 48.06,33.1 48.81,33.86 55.56,33.86 v55.56,34.03
FPGA_ETH_RD_P  (via drill 0.3)
  Top 0.254: v72,45.03 72.07,45.2 70.25,45.2 68.35,43.29 66.44,43.29 57.29,34.15 57.23,34.09 56.6,33.45 55.56,33.45 v55.56,33.28 | JB1.9 45.63,29.65 46.59,28.69 47.31,28.69 v47.31,28.52
  Bottom 0.254: J1411.7 72.31,44.96 72.07,45.2 v72,45.03 | v47.31,28.52 47.31,28.69 48.03,28.69 48.46,29.13 48.46,32.94 48.98,33.45 55.56,33.45 v55.56,33.28
FPGA_ETH_TD_N  (via drill 0.3)
  Top 0.254: v60.96,35.3 60.96,35.13 65.64,35.13 71.29,40.78 v71.17,40.91 | v45.09,29.27 45.09,29.1 44.85,29.1 44.63,29.35 JB1.5
  Bottom 0.254: v60.96,35.3 60.96,35.13 46.59,35.13 46.15,34.69 46.15,29.61 45.64,29.1 45.4,29.1 v45.09,29.27 | v71.17,40.91 71.29,40.78 72.42,41.91 J1411.4
FPGA_ETH_TD_P  (via drill 0.3)
  Top 0.254: v60.96,34.55 60.96,34.72 65.81,34.72 71.58,40.5 v71.7,40.37 | v45.09,28.52 45.09,28.69 44.68,28.69 44.13,29.24 JB1.3
  Bottom 0.254: v60.96,34.55 60.96,34.72 46.76,34.72 46.56,34.52 46.56,29.44 45.8,28.69 45.4,28.69 v45.09,28.52 | v71.7,40.37 71.58,40.5 72.22,40.81 72.45,40.89 J1411.3
FPGA_FT_12MHZ  (via drill 0.3)
  Top 0.152: JB2.99 68.82,63.5 v68.9,63.5
  Bottom 0.152: v68.9,63.5 68.9,64.14 68.58,64.45 R0941.1
FPGA_FT_CTS
  Top 0.152: JB2.87 65.09,62.85 65.09,64.14 64.77,64.45 R0964.2
FPGA_FT_DCD
  Top 0.152: JB2.95 66.99,62.95 66.99,63.82 67.94,64.77 R0967.2
FPGA_FT_DSR
  Top 0.152: JB2.93 66.67,62.85 66.67,64.14 66.04,64.77 R0966.2
FPGA_FT_DTR  (1 unrouted)
FPGA_FT_RESET  (1 unrouted)
FPGA_FT_RI
  Top 0.152: JB2.97 67.63,63.82 68.26,64.45 69.53,64.45 69.85,64.77 R0968.2
FPGA_FT_RTS  (1 unrouted)
FPGA_FT_RXD
  Top 0.152: JB2.83 64.14,63.82 63.5,64.45 R0962.2
FPGA_FT_TXD  (1 unrouted)
FPGA_JTAGEN  (1 unrouted)
FPGA_RESET  (2 unrouted)
FPGA_RESET_R  (1 unrouted)
FPGA_RFX_MODE
  Top 0.152: JB2.75 62.23,62.91 R0861.1
FPGA_SRST  (1 unrouted)
FPGA_TCK  (1 unrouted)
FPGA_TDI  (via drill 0.3)
  Top 0.152: JB2.96 66.99,58.97 66.99,58.42 v67.94,57.47
  Bottom 0.152: v67.94,57.47 R1335.2
FPGA_TDO  (1 unrouted)
FPGA_TMS  (1 unrouted)
FT_AGND  (via drill 0.3)
  Top 0.152: v53.98,43.5 54.93,44.45 56.83,44.45 57.15,44.77 v57.15,47.31
  Bottom 0.152: L0911.2 55.85,51.89 U0911.4 55.85,47.97 56.2,47.62 56.83,47.62 v57.15,47.31 57.78,46.67 58.42,46.67 58.74,46.99 58.74,47.62 58.42,47.94 58.42,48.63 U0911.9 | U0911.41 53.82,43.65 v53.98,43.5
FT_CTS  (1 unrouted)
  Bottom 0.152: U0911.16 61.43,45.72 62.55,45.72
FT_DCD  (1 unrouted)
  Bottom 0.152: U0911.19 61.52,44.13 62.87,44.13
FT_DSR  (1 unrouted)
  Bottom 0.152: U0911.18 61.42,44.77 62.87,44.77
FT_DTR
  Bottom 0.152: R0965.1 63.95,45.25 U0911.17
FT_EEDATA
  Bottom 0.152: U0911.43 52.78,44.77 51.75,44.77 51.44,45.09 R0931.1
FT_OSCI  (1 unrouted)
FT_REF
  Bottom 0.152: R0911.2 58.72,51.12 56.52,51.12 56.35,50.95 U0911.5
FT_RESET
  Bottom 0.152: U0911.34 55.56,40.09 55.56,39.37 55.24,39.05 R0913.2 55.23,37.47 R0912.2
FT_RI  (1 unrouted)
  Bottom 0.152: U0911.20 61.47,43.81 62.55,43.81 62.87,43.5
FT_RTS
  Bottom 0.152: R0963.1 64.02,46.25 U0911.15
FT_RXD  (1 unrouted)
  Bottom 0.152: U0911.14 61.48,46.67 62.87,46.67 63.18,46.99
FT_RXLED
  Bottom 0.152: U0911.27 59.05,40.09 59.05,39.37 59.69,38.73 R0971.1
FT_RXLED_D  (1 unrouted)
FT_TXD
  Bottom 0.152: U0911.13 61.46,47.31 62.55,47.31 62.87,47.62 R0961.1
FT_TXLED
  Bottom 0.152: U0911.28 58.42,40.17 R0972.1
FT_TXLED_D  (1 unrouted)
FT_VCCA
  Bottom 0.152: U0911.37 52.84,41.59 51.75,41.59 51.44,41.27 C0913.2
FT_VCCCORE
  Bottom 0.152: U0911.38 52.82,42.23 51.75,42.23 51.44,42.55 C0912.2
FT_VCCD  (via drill 0.3)
  Top 0.152: v60.33,41.59 58.89,43.03 L0921.2 L0922.2 55.73,43.03 55.24,42.55 v54.29,42.55
  Bottom 0.152: U0911.24 61.24,41.59 v60.33,41.59 60.01,41.91 60.01,48.54 U0911.12 | U0911.39 53.01,42.55 v54.29,42.55 54.61,42.86 54.61,45.72 54.29,46.04 53.01,46.04 U0911.46 52.79,46.04 49.53,46.04 48.88,45.39 R0931.2
FT_VPHY  (via drill 0.3)
  Top 0.152: C0922.2 55.09,45.87 L0922.1 55.88,46.99 v55.56,47.31
  Bottom 0.152: U0911.3 55.24,48.59 55.24,47.62 v55.56,47.31
FT_VPLL  (via drill 0.3)
  Top 0.152: C0921.2 59.21,45.87 L0921.1 58.42,46.99 v58.1,47.31
  Bottom 0.152: U0911.8 57.78,48.63 57.78,47.62 v58.1,47.31
GND  (via drill 0.3)  (143 unrouted)
  Top 0.152: X1311.GND 55.85,83.79 54.61,82.55 52.69,82.55 C1311.1 R1311.1 | L0702.1 19.7,28.12 C0701.2 19.7,26.05 v19.68,25.88 | v5.4,24.77 6.33,24.77 C0611.2 6.37,24.77 6.99,24.77 7.29,25.07 U0601.2 | U0601.8 6.64,33.04 5.7,33.99 C0612.2 5.4,34.59 v5.4,34.92 | v9.53,43.18 9.53,42.56 C0711.2 9.54,42.24 8.89,41.59 8.89,40.32 9.21,40.01 9.76,40.01 U0711.2 | L0701.1 v13.97,49.53 | U0811.2 17.78,54.93 18.1,54.61 19.05,54.61 19.7,55.26 | U0881.4 19.05,72.17 v20,71.12 19.05,70.06 U0881.3 | U0881.6 16.51,72.17 v15.56,71.44 15.63,71.37 U0881.1 | U0821.8 19.8,64.25 20,64.45 20,65.41 20.32,65.72 20.94,65.72 C0853.2 21.57,65.74 v21.75,65.72 | U0821.4 18.53,61.8 19.05,61.28 v19.37,61.28 | v17.14,77.47 C0891.2 | v17.14,82.55 C593.2 | D1021.3 D1021.2 | D1021.2 D1021.1 | D1021.2 29.69,16.51 v29.84,16.67 | R1338.2 54.55,74.94 X1331.1 | JB1.89 65.63,28.98 v65.72,28.89 | JB1.73 61.63,28.93 v61.59,28.89 61.63,28.86 JB1.74 | JB1.83 v64.13,28.9 v64.14,28.89 | JB1.63 59.13,28.97 v59.05,28.89 59.13,28.82 JB1.64 | JB1.25 49.63,29.43 v50.16,28.89 50.63,28.43 JB1.30 | JB1.7 45.13,32.11 v45.4,32.38 | JB1.1 43.63,32.25 v43.5,32.38 | JB1.33 51.63,32.26 v51.75,32.38 | JB1.43 54.13,32.22 v54.29,32.38 | JB1.53 56.63,32.27 v56.52,32.38 | JB1.54 56.63,25.52 v56.52,25.4 | JB3.5 33.05,38.73 v34.92,38.73 36.7,38.73 JB3.6 | JB3.11 33.14,40.32 v34.92,40.32 | JB3.17 33.15,41.59 33.97,41.59 34.29,41.91 v34.92,41.91 35.56,41.91 35.88,41.59 36.61,41.59 JB3.18 | JB3.24 36.7,43.18 v34.92,43.18 33.06,43.18 JB3.23 | JB3.29 33.09,44.77 v34.92,44.77 36.67,44.77 JB3.30 | JB3.35 33.17,46.35 v34.92,46.35 36.59,46.35 JB3.36 | JB3.45 33.16,48.58 v34.92,48.58 36.6,48.58 JB3.46
  Top 0.152: JB2.19 48.26,62.68 v48.26,60.96 | JB2.29 50.8,62.64 v50.8,60.96 | JB2.39 53.02,62.7 53.02,61.28 v53.34,60.96 53.02,60.64 53.02,59.22 JB2.40 | JB2.49 55.56,62.74 55.56,61.28 v55.88,60.96 55.56,60.64 55.56,59.18 JB2.50 | JB2.60 58.1,59.14 58.1,60.64 v57.78,60.96 58.1,61.28 58.1,62.78 JB2.59 | JB2.69 60.64,62.8 v60.64,60.96 60.64,59.12 JB2.70 | JB2.80 63.18,59.16 v63.18,60.96 63.18,62.76 JB2.79 | JB2.89 65.72,62.72 v65.72,60.96 | v52.7,47.94 52.69,47.93 C0922.1 | C0921.1 61.59,47.01 v61.59,47.94
  Top 0.3: L0721.1 17.38,48.49 v17.46,48.58 | 19.7,55.26 C0811.2 | v13.34,65.56 13.34,64.78 C0852.2 | v13.34,61.44 13.34,62.22 C0851.2 | v16.19,88.9 16.19,87.5 X0891.GND4 17.45,87.19 X0891.GND1 | v16.51,87 16.19,86.68 v16.19,85.41 | v21.91,88.9 21.91,87.5 X0891.GND3 20.65,87.19 X0891.GND2 | v21.91,85.41 21.59,85.72 v21.59,87 | 55.85,83.79 55.88,83.76 v55.88,83.19 | X0895.GND4 25.4,88.58 v25.08,88.9 | v25.08,85.41 25.4,85.72 v25.4,87 X0895.GND4 | v30.8,85.41 30.8,86.68 v30.48,87 X0895.GND3 | v30.8,88.9 30.8,87.5 X0895.GND3 | X0895.GND1 25.53,87.31 X0895.GND4 | X0895.GND2 30.35,87.31 X0895.GND3
  Top 0.406: C1152.2 C1153.2 81.91,73.34 83.5,74.93 C1122.2 83.82,76.2 C1114.1 C1113.1 C1112.1 C1111.1 76.2,80.01 v75.56,79.38 | v78.74,73.98 78.74,73.34 | v80.01,79.69 80.01,80.33 | C1101.1 68.11,87.15 v67.94,87.31 | C1151.2 67.31,70.48 v66.67,69.85
  Bottom 0.152: U0501.5 53.72,4.18 53.98,4.45 53.98,4.91 C0501.2 R0531.1 | C1012.2 27.65,8.72 X1011.C 27.65,6.52 C1011.2 | X1011.D 12.05,7.11 arc-90 C1013.2 | J1411.2 72.4,39.67 v72.07,39.37 | J1411.11 72.72,49.2 v72.07,48.58 72.64,48.01 J1411.10 | R1103.1 67.31,86.68 v67.94,87.31 | R1105.1 68.58,86.68 v67.94,87.31 | v67.94,87.31 68.11,87.15 C1101.1 69.85,86.67 R1106.1 C1102.1 72.69,86.38 v72.71,86.36 | R1101.1 v63.5,77.47 | v45.4,23.5 46.34,23.5 C1381.1 | C1441.2 68.59,45.73 v69.53,46.67 70.17,46.04 C1442.2 | R0913.1 55.23,36.2 v54.29,36.2 | U0911.35 U0911.36 54.33,40.32 53.98,40.32 v53.66,40.01 | C0912.1 v47.94,42.55 | C0911.2 C0912.1 | C0913.1 C0912.1 | v52.7,47.94 52.7,47.34 U0911.48 U0911.47 | v62.87,42.23 62.84,42.25 U0911.23 U0911.22 | U0911.10 U0911.11 59.35,50.46 v60.01,51.12 61.28,51.12 61.59,51.44 61.59,52.69 R0911.1 | L0911.1 v52.39,52.7 | U0911.42 53.64,44.15 53.66,44.13 v53.98,44.45
  Bottom 0.3: v22.54,47.31 L0722.2 L0722.5
  other vias: 17.78,63.5 26.04,82.55 26.04,77.47 69.53,40.32
  pour Top (isolate 0.305): 95.29,0.64 3.13,0.64 arc-90 0.64,3.13 0.64,86.4 arc-90 3.13,88.9 95.29,88.9 arc-90 97.79,86.4 97.79,3.13 arc-90
  pour Route2 (isolate 0.305, rank 2): 95.29,0.64 3.13,0.64 arc-90 0.64,3.13 0.64,86.4 arc-90 3.13,88.9 95.29,88.9 arc-90 97.79,86.4 97.79,3.13 arc-90
  pour Bottom (isolate 0.305): 95.29,0.64 3.13,0.64 arc-90 0.64,3.13 0.64,86.4 arc-90 3.13,88.9 95.29,88.9 arc-90 97.79,86.4 97.79,3.13 arc-90
JC_SRST
  Top 0.152: R1337.1 42.26,69.26 X1331.14
JC_TCK
  Top 0.152: R1333.1 50.26,69.33 X1331.6
JC_TDI  (1 unrouted)
JC_TDO
  Top 0.152: R1334.1 X1331.8
JC_TMS
  Top 0.152: R1332.1 52.26,69.42 X1331.4
JC_VCCO_0  (1 unrouted)
JTAG_CPLD_EN
  Top 0.152: R1339.1 57.15,72.39 | 57.15,72.39 R1338.1 | X1332.2 57.15,72.39
LCD_BL_B
  Bottom 0.152: R0551.2 arc90 75.1,13.52 T0551.1 72.69,15.56 arc-90 R0552.1
LCD_BL_K
  Bottom 0.152: T0551.3 79.97,16.51 arc90 U0501.11
LCD_CAP1N
  Bottom 0.152: C0511.2 49.91,4.85 U0501.2
LCD_CAP1P
  Bottom 0.152: C0511.1 51.17,4.88 U0501.3
LCD_NRST
  Bottom 0.152: U0501.8 57.52,4.88 R0531.2 57.32,6.83 R0532.2
LCD_VOUT
  Bottom 0.152: C0512.1 48.63,4.24 U0501.1
LED_B_E
  Bottom 0.152: R0553.2 74.93,17.63 arc90 T0551.2
LED_RGB_BLUE
  Top 0.152: D1021.6 26.72,15.61 26.99,15.88 26.99,17.78 27.3,18.41 R1023.1
LED_RGB_GREEN
  Top 0.152: D1021.5 26.04,16.51 26.35,16.83 26.35,18.41 R1022.1
LED_RGB_RED
  Top 0.152: D1021.4 24.97,19.46 arc90 R1021.1
PE09_RF1
  Top 0.3: U0811.1 18.46,55.61 19.05,56.2 C0831.2
PE09_RF2
  Top 0.3: C0832.2 16.51,56.23 U0811.3
PE09_RFC
  Top 0.3: U0811.5 C0821.1
PMIC3V3_SW  (1 unrouted)
RFX_DET  (2 unrouted)
RFX_IND
  Top 0.152: U0821.10 18.03,65.79 16.93,66.89 L0821.1
RFX_MODE  (1 unrouted)
RFX_RXEN  (1 unrouted)
RFX_TXEN  (2 unrouted)
RFX_VDD3  (1 unrouted)
ROT_I
  Bottom 0.152: X1011.A 26.65,5.22 C1011.1 28.88,5.08 R1011.1
ROT_P
  Bottom 0.152: C1013.1 arc-90 12.05,8.44 X1011.E 14.55,10.12 arc90 R1013.1
ROT_Q
  Bottom 0.152: X1011.B 26.65,10.02 C1012.1 28.88,10.16 R1012.1
TPS2_EN  (1 unrouted)
TPS_COR
  Bottom 0.152: R1131.2 C1131.2 68.91,69.2 64.77,73.34 C1132.1
TPS_EN  (via drill 0.3)
  Top 0.152: U1101.2 69.12,76.74 68.58,76.2 67.31,76.2 66.04,77.47 D1161.A 66.04,78.74 v65.41,79.38 | v71.12,87.63 R1161.1
  Bottom 0.152: v65.41,79.38 64.45,80.33 64.45,86.36 66.36,88.27 70.8,88.27 71.12,87.95 v71.12,87.63
TPS_LL  (via drill 0.3)
  Top 0.152: U1101.6 71.12,76.2 72.5,74.82 L1101.2 | U1101.7 71.62,74.82 L1101.2 | U1101.8 72.12,74.82 L1101.2 | U1101.9 72.62,74.82 L1101.2 | U1101.10 73.12,74.82 L1101.2 | U1101.11 73.62,74.82 L1101.2 | R1122.2 76.2,76.2 74.93,74.93
  Top 0.406: L1101.2 73.3,74.93 74.93,74.93 75.25,74.93 v75.56,74.61
  Bottom 0.152: C1108.1 74.61,71.44 74.93,71.12 R1131.1
  Bottom 0.406: C1108.1 v75.56,74.61
TPS_LL_RC
  Top 0.152: C1122.1 R1122.1
TPS_MODE  (via drill 0.3)
  Top 0.152: U1101.20 69.62,83.1 v68.9,83.82
  Bottom 0.152: R1106.2 69.85,84.77 v68.9,83.82
TPS_PGOOD  (via drill 0.3)
  Top 0.152: U1101.3 69.62,76.29 v69.22,75.88
  Bottom 0.152: R1107.1 68.91,75.58 v69.22,75.88
TPS_RF  (via drill 0.3)
  Top 0.152: U1101.22 67.69,82.48 v67.31,82.87
  Bottom 0.152: R1103.2 v67.31,82.87 R1104.2
TPS_TRIP  (via drill 0.3)
  Top 0.152: U1101.21 69.12,82.96 68.9,83.19 68.58,83.19 v67.94,83.82
  Bottom 0.152: R1105.2 68.58,84.45 v67.94,83.82
TPS_VBST  (via drill 0.3)
  Top 0.152: U1101.4 70.12,75.93 v70.17,75.88
  Bottom 0.152: R1108.1 69.85,74.93 70.17,75.25 v70.17,75.88
TPS_VBST_R
  Bottom 0.152: R1108.2 71.75,72.39 72.07,72.39 72.71,73.03 C1108.2
TPS_VFB  (via drill 0.3)
  Top 0.152: U1101.1 68.01,77.53 v67.63,77.15
  Bottom 0.152: v67.63,77.15 67.31,77.47 R1101.2 66.67,77.45 66.67,76.83 66.04,76.2 R1102.1 C1132.2
TPS_VIN  (1 unrouted)
  Top 0.152: U1101.16 71.62,83.5 | U1101.15 72.12,83.5 | U1101.14 72.62,83.5 | U1101.13 73.12,83.5 | 71.62,83.5 72.12,83.5 | 72.12,83.5 72.62,83.5 | 72.62,83.5 73.12,83.5 | 73.12,83.5 73.66,83.5 | 73.66,83.5 74.3,83.5 74.3,82.55 | 71.62,83.5 71.12,82.87 U1101.17 | 73.66,83.5 73.66,82.55 | U1101.19 70.12,84.09 | 70.12,84.09 70.17,84.14 71.12,84.14 | 71.12,84.14 71.62,84.14 71.62,83.5 | C1101.2 69.69,84.52 70.12,84.09 | R1161.2 71.12,84.14
  Top 0.305: D1112.C 78.74,84.25 C1112.2
  Top 0.406: D1111.C 87.11,82.23 C1114.2 C1113.2 C1112.2 C1111.2 75.89,82.23 75.56,82.55 74.3,82.55
TPS_VREG  (via drill 0.3)
  Top 0.152: U1101.18 70.62,83.32 v70.8,83.5 | D1161.C v66.04,80.64 65.09,80.64 64.45,80.01 64.45,76.83 67.31,73.98 v67.31,73.34
  Bottom 0.152: C1102.2 71.75,84.45 v70.8,83.5 73.66,83.5 74.61,82.55 74.61,78.11 74.3,77.79 68.26,77.79 66.04,80.01 v66.04,80.64 | R1107.2 v67.31,73.34
TRX_AVDD0
  Top 0.152: U0701.14 13.64,42.89 C0707.2
TRX_AVDD1
  Top 0.152: C0708.2 23.22,42.89 U0701.47
TRX_AVSS  (via drill 0.3)  (8 unrouted)
  Top 0.15: U0701.6 U0701.7 18.73,44.21 18.73,45.4 v19.05,45.72
  Top 0.152: U0701.48 22.55,43.52 C0708.1 24.46,45.1 v24.92,45.09 | U0701.3 20.8,44.61 21.27,45.09 v21.27,45.4 | v21.59,38.1 v18.73,38.42 19.05,38.42 v19.05,40.01 U0701.49 19.05,41.59 v17.78,42.86 20.64,42.86 v21.27,42.23 | U0701.10 17.3,44.92 v17.46,45.09 | v13.97,45.72 L0701.2 13.34,44.93 13.34,44.77 12.05,43.48 C0707.1 | U0701.45 23.48,41.89 v23.5,41.91 | U0701.16 14.62,41.89 v14.61,41.91 | U0701.18 15.46,40.8 v14.61,40.8 15.14,40.8 U0701.19
  Bottom 0.152: C0704.2 13.35,45.7 v13.97,45.72
  pour Route2 (isolate 0.305): 11.43,46.99 25.4,46.99 25.4,36.83 11.43,36.83
TRX_CLK_26MHZ  (1 unrouted)
TRX_CLKO_26MHZ_R  (1 unrouted)
TRX_DEVDD  (via drill 0.3)
  Top 0.152: U0701.29 18.3,32.18 v17.78,32.7 17.93,31.9 L0703.2 17.31,31.75 v15.88,31.75 | U0701.21 13.04,39.39 12.7,39.05 v12.7,35.24 | U0701.39 23.66,38.89 v23.81,38.73
  Bottom 0.152: C0703.1 v17.78,32.7 17.78,36.2 18.1,36.51 21.59,36.51 v23.81,38.73 | v12.7,35.24 15.88,32.07 v15.88,31.75
TRX_DVDD
  Top 0.152: U0701.37 23.48,36.96 C0706.2
TRX_DVSS  (via drill 0.3)
  Top 0.152: U0701.38 23.22,38.39 23.5,38.1 24.45,38.1 24.77,37.78 C0706.1 v25.56,36.83 | v20.64,32.07 L0702.2 | U0701.32 19.8,34.92 v20.12,34.49 | U0701.20 14.72,39.89 v14.61,40.01 | U0701.23 v14.61,38.1 14.63,38.07 15.13,37.89 U0701.24
  Bottom 0.152: C0703.2 v20.64,32.07 | v20.64,32.07 20.64,33.97 | 20.64,33.97 23.5,36.83 v25.56,36.83 | v14.61,40.01 v14.61,38.1 14.61,34.29 18.1,30.8 20.32,30.8 20.64,31.11 v20.64,32.07 | 20.64,33.97 v20.12,34.49
TRX_EVDD  (via drill 0.3)  (2 unrouted)
  Top 0.152: L0704.2 11.28,45.57 v11.43,45.72 | U0701.46 23.02,42.39 23.18,42.55 v24.13,42.55 | v13.34,42.23 13.65,42.23 13.97,42.55 14.92,42.55 15.08,42.39 U0701.15
  Bottom 0.152: C0704.1 v11.43,45.72
  pour Route15 (isolate 0.305): 10.16,46.99 25.4,46.99 25.4,41.27 10.16,41.27
TRX_FEA09  (via drill 0.3)  (1 unrouted)
  Top 0.152: 17.13,54.31 15.56,55.88 15.56,58.1 15.88,58.42 17.14,58.42 17.53,58.8 | U0701.11 16.83,44.17 16.83,44.77 16.51,45.09 v16.51,49.21
  Bottom 0.152: v16.51,49.21 R0863.1
TRX_FEB09  (via drill 0.3)
  Top 0.152: U0701.12 15.56,44.88 v15.56,49.53
  Bottom 0.152: v15.56,49.53 15.24,49.85 R0862.1
TRX_IRQ  (via drill 0.3)  (1 unrouted)
  Top 0.152: R0756.2 28.27,38.42 v28.57,38.42
  Bottom 0.152: v28.57,38.42 28.89,38.1 38.1,38.1
TRX_IRQ_R
  Top 0.152: U0701.40 22.57,39.37 26.04,39.37 R0756.1
TRX_MISO  (via drill 0.3)
  Top 0.152: R0754.2 28.27,42.23 v28.57,42.23 | v39.05,42.55 41.91,39.69 42.86,39.69 52.39,49.21 62.87,49.21 64.14,50.48 64.14,57.47 63.82,57.78 62.87,57.78 62.55,58.1 62.55,59.03 JB2.78
  Bottom 0.152: v28.57,42.23 28.89,42.55 v39.05,42.55
TRX_MISO_R
  Top 0.152: U0701.44 25.91,41.39 R0754.1
TRX_MOSI
  Top 0.152: JB2.76 62.23,59.01 62.23,57.78 63.18,56.83 R0753.2
TRX_MOSI_R  (via drill 0.3)
  Top 0.152: U0701.43 22.62,40.96 29.21,40.96 v29.53,41.27 | v42.55,40.96 51.75,50.16 62.55,50.16 63.18,50.8 R0753.1
  Bottom 0.152: v29.53,41.27 29.84,40.96 v42.55,40.96
TRX_RF09
  Top 0.152: L0721.4 18.18,48.02
  Top 0.3: 18.18,48.02 18.41,48.26 18.41,49.52 C0821.2
TRX_RF09_N
  Top 0.152: L0721.2 18.03,45.34 18.03,44.77 17.8,44.38 U0701.9
TRX_RF09_P
  Top 0.152: L0721.3 18.32,46.13 18.32,44.77 18.3,44.43
  Top 0.3: 18.3,44.43 U0701.8
TRX_RF24  (via drill 0.3)
  Top 0.3: L0896.1 27.32,78.54 C0895.1 27.3,77.45 27.3,73.34 25.24,71.28 25.24,50.96 v22.86,48.58
  Bottom 0.3: L0722.1 22.24,47.96 v22.86,48.58
TRX_RF24_N  (via drill 0.3)
  Top 0.3: v19.63,45.09 19.78,45.09 19.78,44.77 19.8,44.74 U0701.5
  Bottom 0.3: L0722.4 19.78,46.62 19.78,45.09 v19.63,45.09
TRX_RF24_P  (via drill 0.3)
  Top 0.3: v20.38,45.09 20.23,45.09 20.3,45.01 U0701.4
  Bottom 0.3: L0722.3 20.23,45.35 20.23,45.09 v20.38,45.09
TRX_RSTN
  Top 0.152: JB2.66 59.69,59.05 59.69,58.1 58.42,56.83 R0755.2
TRX_RSTN_R  (via drill 0.3)
  Top 0.152: R0755.1 58.41,55.24 39.05,55.24 37.78,56.52 v26.35,56.52 | U0701.13 15.12,43.81 v14.61,43.81
  Bottom 0.152: v14.61,43.81 14.61,47.31 14.92,47.62 17.46,47.62 v26.35,56.52
TRX_RXCLK_N  (via drill 0.3)
  Top 0.3: U0701.33 20.3,35.58 21.5,34.38 23.4,34.38 23.97,33.81 v23.86,33.71 | JB1.22 48.63,17.5 48.67,17.46 v48.53,17.41
  Bottom 0.3: v23.86,33.71 23.97,33.81 26.45,31.34 26.45,21.81 29.75,18.51 47.94,18.51 48.17,18.51 48.48,18.51 48.67,18.32 48.67,17.46 v48.53,17.41
TRX_RXCLK_P  (via drill 0.3)
  Top 0.3: U0701.34 20.8,35.72 21.68,34.83 23.59,34.83 24.29,34.13 v24.39,34.24 | JB1.24 49.13,17.47 49.12,17.46 v49.26,17.41
  Bottom 0.3: v24.39,34.24 24.29,34.13 26.89,31.53 26.89,22 29.94,18.96 47.94,18.96 48.26,18.96 48.35,18.96 48.67,18.96 49.12,18.51 49.12,17.46 v49.26,17.41
TRX_RXD09_N  (via drill 0.3)
  Top 0.3: U0701.30 18.8,33.59 19.27,33.11 22.13,33.11 22.7,32.54 v22.59,32.44 | JB1.20 48.17,26.92 48.17,24.99 46.9,23.72 46.9,16.51 v47.05,16.51
  Bottom 0.3: v22.59,32.44 22.7,32.54 23.91,31.34 23.91,19.27 28.8,14.38 46.13,14.38 46.9,15.15 46.9,16.51 v47.05,16.51
TRX_RXD09_P  (via drill 0.3)
  Top 0.3: U0701.31 19.3,33.72 19.46,33.56 22.32,33.56 23.02,32.86 v23.12,32.97 | JB1.18 47.72,26.8 47.72,25.18 46.45,23.91 46.45,16.51 v46.3,16.51
  Bottom 0.3: v23.12,32.97 23.02,32.86 24.36,31.53 24.36,19.46 28.99,14.83 45.94,14.83 46.45,15.33 46.45,16.51 v46.3,16.51
TRX_RXD24_N  (via drill 0.3)
  Top 0.3: U0701.35 21.3,36.48 22.13,35.65 24.99,35.65 25.56,35.08 v25.45,34.98 | JB1.26 49.62,26.89 49.62,25.31 51.21,23.72 51.21,20.32 v51.06,20.32
  Bottom 0.3: v25.45,34.98 25.56,35.08 28.98,31.66 28.98,24.04 31.66,21.36 50.71,21.36 51.21,20.86 51.21,20.32 v51.06,20.32
TRX_RXD24_P  (via drill 0.3)
  Top 0.3: U0701.36 21.8,36.62 22.32,36.1 25.18,36.1 25.88,35.4 v25.98,35.51 | JB1.28 50.07,26.83 50.07,25.49 51.66,23.91 51.66,20.32 v51.81,20.32
  Bottom 0.3: v25.98,35.51 25.88,35.4 29.43,31.84 29.43,24.22 31.84,21.82 50.89,21.82 51.66,21.05 51.66,20.32 v51.81,20.32
TRX_SCLK
  Top 0.152: JB2.72 61.28,58.96 61.28,58.42 60.01,57.15 R0751.2
TRX_SCLK_R  (via drill 0.3)  (1 unrouted)
  Top 0.152: U0701.41 22.66,40.01 26.99,40.01 27.3,39.69 29.21,39.69 v29.53,39.37
  Bottom 0.152: v29.53,39.37 35.56,39.37 35.88,39.05 38.1,39.05
TRX_SELN
  Top 0.152: JB2.74 61.59,59.08 R0752.2
TRX_SELN_R  (via drill 0.3)  (1 unrouted)
  Top 0.152: U0701.42 22.62,40.32 v28.26,40.32
  Bottom 0.152: v28.26,40.32 33.97,40.32 34.61,39.69 38.1,39.69
TRX_TCXO
  Top 0.152: U0701.17 14.1,41.39 C0712.2
TRX_TXCLK_N
  Top 0.3: JB1.15 47.13,32.24 45.94,33.43 41.69,33.43 38.64,30.39 38.64,25.94 35.34,22.64 16.42,22.64 12.47,26.58 12.47,32.8 16.29,36.61 16.29,37.14 U0701.25
TRX_TXCLK_P
  Top 0.3: JB1.17 47.63,32.38 46.13,33.88 41.5,33.88 38.19,30.57 38.19,26.13 35.15,23.09 16.6,23.09 12.93,26.76 12.93,32.61 16.8,36.48 U0701.26
TRX_TXD_N
  Top 0.3: JB1.21 48.63,33.28 46.9,35.02 39.78,35.02 37.24,32.48 28.99,32.48 21.05,24.54 17.69,24.54 14.38,27.85 14.38,32.48 17.3,35.4 U0701.27
TRX_TXD_P
  Top 0.3: JB1.23 49.13,33.42 47.08,35.47 39.59,35.47 37.05,32.93 28.8,32.93 20.86,24.99 17.87,24.99 14.83,28.03 14.83,32.29 17.8,35.26 U0701.28
U1V8  (2 unrouted)
U3V3  (6 unrouted)
U3V3_JTAGREF  (via drill 0.3)
  Top 0.152: JB2.92 66.04,59.02 v66.04,57.47
  Bottom 0.152: v66.04,57.47 R1331.2
USB_D_M  (1 unrouted)
USB_D_P  (1 unrouted)
USB_SHIELD
  Top 0.152: R1311.2 C1311.2 51.94,85.74 52.95,86.75 | 52.95,86.75 X1311.JSHIELD@6 X1311.JSHIELD@5 X1311.JSHIELD@4 X1311.JSHIELD@3 60.96,87.14 60.96,86.36 59.65,85.05 X1311.JSHIELD | X1311.JSHIELD@2 54.65,85.05 52.95,86.75
USB_VBUS
  Top 0.152: X1311.VBUS 58.42,84.47
  Top 0.3: 58.42,84.47 58.42,82.55 59.56,81.41 PF1311.2
VCCIO13  (via drill 0.3)  (2 unrouted)
  Top 0.152: JB2.4 v44.13,57.47
  Bottom 0.152: R0201.2 R0202.2 v44.13,57.47
VCCIO16  (via drill 0.3)  (1 unrouted)
  Top 0.152: JB1.10 45.63,25.81 v45.72,25.72 46.13,26.13 JB1.12
  Bottom 0.152: C1381.2 46.02,24.78 45.72,25.08 v45.72,25.72
  Bottom 0.406: X1381.1 X1381.3 X1381.5
VCTCXO_OUT
  Top 0.152: U0711.3 9.82,41.27 10.48,41.27 11.11,40.64 C0712.1
VCTCXO_VC
  Top 0.152: C0621.1 R0621.2 7.63,37.48 7.94,37.78 7.94,39.99 U0711.1
VIN_PWR
  Top 0.406: 87.71,78.31 X1361.7
  Top 1.016: D1111.A 87.71,78.31
  Bottom 0.152: 87.71,72.39 X1361.7

## Text on the board
Top: TOP
Route2: L2
Route15: L3
Bottom: BOT
tPlace: ANT09 | ANT24 | USB | RX | TX | JTAG | CPLD_EN | GND | 12V | TE0712-02-100-2C3 | UFBmod V2.0 / (C) 2019 / by DF4IAH | VCCIO16 | 1.8V | 2.5V | 3.3V
tNames: X591 | X595
tDocu: WDG20..WDG24